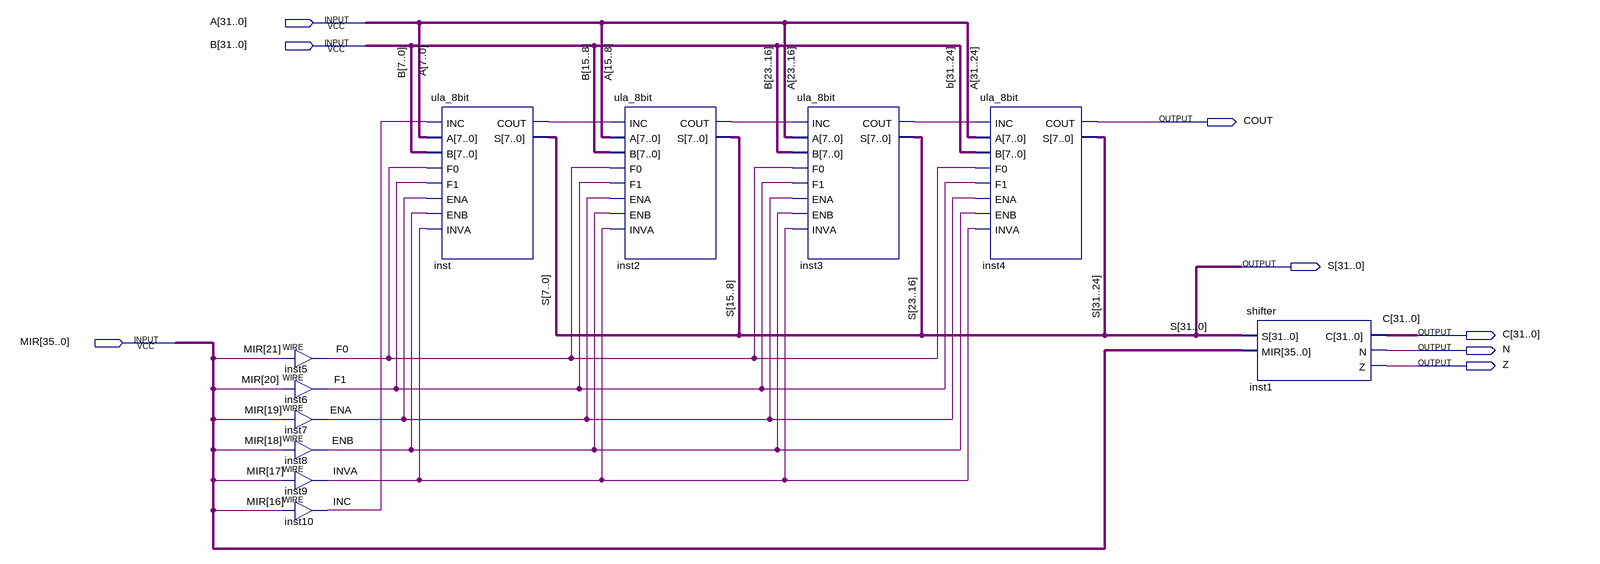
[diagram p0: schematic sheet]
// Quartus schematic ula_32bit.bdf as structural Verilog: 11 symbols, 8 pins
module ula_32bit (
  input  [31:0] A,
  input  [31:0] B,
  input  [35:0] MIR,
  output COUT,
  output [31:0] S,
  output [31:0] C,
  output N,
  output Z
);

  wire ENA, ENB, F0, F1, INC, inst2_cout, inst3_cout, inst_cout, INVA;

  assign F0 = MIR[21];  // WIRE inst5
  assign F1 = MIR[20];  // WIRE inst6
  assign ENA = MIR[19];  // WIRE inst7
  assign ENB = MIR[18];  // WIRE inst8
  assign INVA = MIR[17];  // WIRE inst9
  assign INC = MIR[16];  // WIRE inst10
  ula_8bit inst (
    .A(A[7:0]), .B(B[7:0]), .INC(INC), .F0(F0), .F1(F1), .ENA(ENA), .ENB(ENB), .INVA(INVA), .COUT(inst_cout),
    .S(S[7:0]));
  ula_8bit inst2 (
    .A(A[15:8]), .B(B[15:8]), .INC(inst_cout), .F0(F0), .F1(F1), .ENA(ENA), .ENB(ENB), .INVA(INVA),
    .COUT(inst2_cout), .S(S[15:8]));
  ula_8bit inst3 (
    .A(A[23:16]), .B(B[23:16]), .INC(inst2_cout), .F0(F0), .F1(F1), .ENA(ENA), .ENB(ENB), .INVA(INVA),
    .COUT(inst3_cout), .S(S[23:16]));
  ula_8bit inst4 (
    .A(A[31:24]), .B(B[31:24]), .INC(inst3_cout), .F0(F0), .F1(F1), .ENA(ENA), .ENB(ENB), .INVA(INVA),
    .COUT(COUT), .S(S[31:24]));
  shifter inst1 (.S(S), .MIR(MIR), .N(N), .C(C), .Z(Z));
endmodule
